# Altium project Popsicle Stick V2.PrjPcb
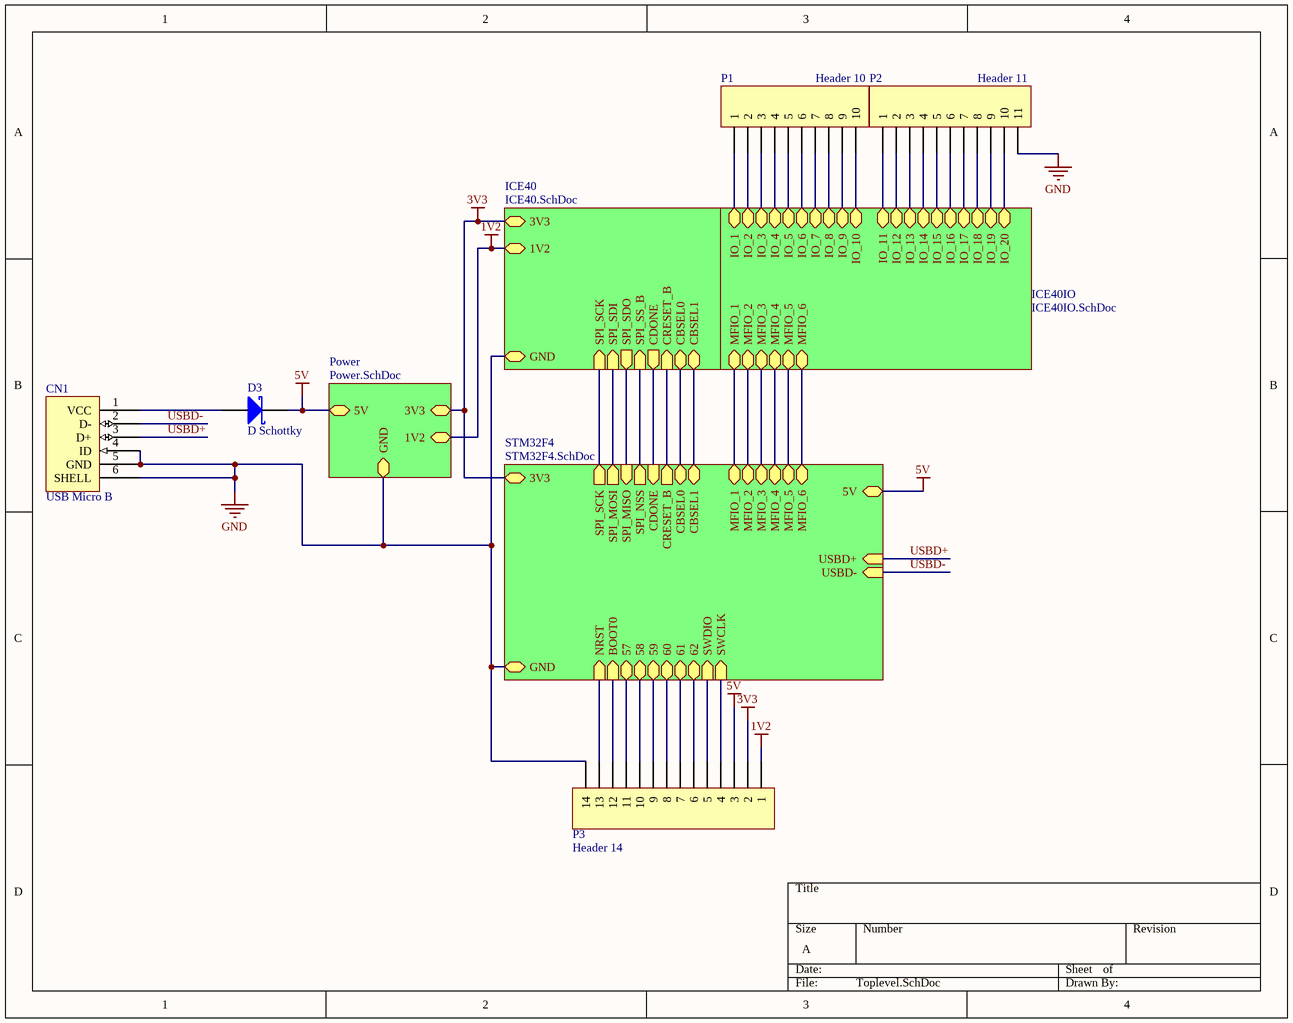
[diagram p0: Toplevel.SchDoc]
5 sheets, 61 parts. Net scope: hierarchical (ports join the sheet entries above them; power ports are global).
Board file: PCB1.PcbDoc
Sheets:
  Toplevel.SchDoc
    Power = Power.SchDoc
    ICE40 = ICE40.SchDoc
    ICE40IO = ICE40IO.SchDoc
    STM32F4 = STM32F4.SchDoc

## Sheet Toplevel.SchDoc
size A

### Parts
CN1  USB Micro B
D3  D Schottky  [SMB]
P1  Header 10  [HDR1X10]
P2  Header 11  [HDR1X11]
P3  Header 14  [HDR1X14]

### Sub-sheets
ICE40 = ICE40.SchDoc: 3V3, 1V2, GND, SPI_SCK (in), SPI_SDI (in), SPI_SDO (out), SPI_SS_B (in), CDONE (out), CRESET_B (in), CBSEL1 (bidir), CBSEL0 (bidir)
ICE40IO = ICE40IO.SchDoc: MFIO_1 (bidir), MFIO_2 (bidir), MFIO_3 (bidir), MFIO_4 (bidir), MFIO_6 (bidir), IO_1 (bidir), IO_2 (bidir), IO_3 (bidir), IO_4 (bidir), IO_5 (bidir), IO_6 (bidir), IO_8 (bidir), IO_9 (bidir), IO_10 (bidir), IO_12 (bidir), IO_13 (bidir), IO_11 (bidir), IO_14 (bidir), IO_15 (bidir), IO_16 (bidir), IO_17 (bidir), IO_18 (bidir), IO_19 (bidir), IO_20 (bidir), IO_7 (bidir), MFIO_5 (bidir)
Power = Power.SchDoc: GND, 5V, 3V3, 1V2
STM32F4 = STM32F4.SchDoc: SPI_SCK (out), SPI_MOSI (out), SPI_MISO (in), SPI_NSS (out), CDONE (in), CRESET_B (out), CBSEL0 (bidir), CBSEL1 (bidir), MFIO_1 (bidir), MFIO_2 (bidir), MFIO_3 (bidir), MFIO_4 (bidir), MFIO_5 (bidir), MFIO_6 (bidir), NRST (in), BOOT0 (in), 57 (bidir), 58 (bidir), 59 (bidir), 60 (bidir), 61 (bidir), 62 (bidir), 3V3, GND, USBD+ (in), USBD- (in), SWCLK (in), SWDIO (in), 5V

### Nets
1V2: P3.1 ; sheet Power/1V2, sheet ICE40/1V2
3V3: P3.2 ; sheet Power/3V3, sheet ICE40/3V3, sheet STM32F4/3V3
5V: D3.2(K) P3.3 ; sheet Power/5V, sheet STM32F4/5V
GND: CN1.4(ID) CN1.5(GND) CN1.6(SHELL) P2.11 P3.14 ; sheet Power/GND, sheet ICE40/GND, sheet STM32F4/GND
USBD+: CN1.3(D+) ; sheet STM32F4/USBD+
USBD-: CN1.2(D-) ; sheet STM32F4/USBD-
NetC28_1: P3.13 ; sheet STM32F4/NRST
NetCN1_1: CN1.1(VCC) D3.1(A)
NetP1_1: P1.1 ; sheet ICE40IO/IO_1
NetP1_2: P1.2 ; sheet ICE40IO/IO_2
NetP1_3: P1.3 ; sheet ICE40IO/IO_3
NetP1_4: P1.4 ; sheet ICE40IO/IO_4
NetP1_5: P1.5 ; sheet ICE40IO/IO_5
NetP1_6: P1.6 ; sheet ICE40IO/IO_6
NetP1_7: P1.7 ; sheet ICE40IO/IO_7
NetP1_8: P1.8 ; sheet ICE40IO/IO_8
NetP1_9: P1.9 ; sheet ICE40IO/IO_9
NetP1_10: P1.10 ; sheet ICE40IO/IO_10
NetP2_1: P2.1 ; sheet ICE40IO/IO_11
NetP2_2: P2.2 ; sheet ICE40IO/IO_12
NetP2_3: P2.3 ; sheet ICE40IO/IO_13
NetP2_4: P2.4 ; sheet ICE40IO/IO_14
NetP2_5: P2.5 ; sheet ICE40IO/IO_15
NetP2_6: P2.6 ; sheet ICE40IO/IO_16
NetP2_7: P2.7 ; sheet ICE40IO/IO_17
NetP2_8: P2.8 ; sheet ICE40IO/IO_18
NetP2_9: P2.9 ; sheet ICE40IO/IO_19
NetP2_10: P2.10 ; sheet ICE40IO/IO_20
NetP3_4: P3.4 ; sheet STM32F4/SWCLK
NetP3_5: P3.5 ; sheet STM32F4/SWDIO
NetP3_6: P3.6 ; sheet STM32F4/62
NetP3_7: P3.7 ; sheet STM32F4/61
NetP3_8: P3.8 ; sheet STM32F4/60
NetP3_9: P3.9 ; sheet STM32F4/59
NetP3_10: P3.10 ; sheet STM32F4/58
NetP3_11: P3.11 ; sheet STM32F4/57
NetP3_12: P3.12 ; sheet STM32F4/BOOT0
NetR3_1: sheet ICE40/CRESET_B, sheet STM32F4/CRESET_B
NetR4_1: sheet ICE40/CDONE, sheet STM32F4/CDONE
NetR5_1: sheet ICE40/SPI_SDI, sheet STM32F4/SPI_MOSI
NetR6_1: sheet ICE40/SPI_SCK, sheet STM32F4/SPI_SCK
NetR7_1: sheet ICE40/SPI_SS_B, sheet STM32F4/SPI_NSS
NetU1_63: sheet ICE40/CBSEL0, sheet STM32F4/CBSEL0
NetU1_64: sheet ICE40/CBSEL1, sheet STM32F4/CBSEL1
NetU1_67: sheet ICE40/SPI_SDO, sheet STM32F4/SPI_MISO
NetU1_73: sheet ICE40IO/MFIO_1, sheet STM32F4/MFIO_1
NetU1_74: sheet ICE40IO/MFIO_2, sheet STM32F4/MFIO_2
NetU1_75: sheet ICE40IO/MFIO_3, sheet STM32F4/MFIO_3
NetU1_76: sheet ICE40IO/MFIO_4, sheet STM32F4/MFIO_4
NetU1_78: sheet ICE40IO/MFIO_5, sheet STM32F4/MFIO_5
NetU1_79: sheet ICE40IO/MFIO_6, sheet STM32F4/MFIO_6

### Library data of the parts
CN1 = USB Micro B: Manuf_Part_1: 5075BMR-05-SM; Order: 5075BMR-05-SM; ECCN: ????
D3 = D Schottky: Schottky Diode; Published: 8-Jun-2000; LatestRevisionDate: 17-Jul-2002; LatestRevisionNote: Re-released for DXP Platform.; PackageReference: SMB; Publisher: Altium Limited; PackageDescription: DO-214-AA/SMB; 2 C-Bend Leads; Body 5.3 x 3.6 mm, inc. leads (LxW); Code_JEDEC: DO-214-AA
P1 = Header 10: Header, 10-Pin; LatestRevisionDate: 17-Jul-2002; LatestRevisionNote: Re-released for DXP Platform.; Publisher: Altium Limited
P2 = Header 11: Header, 11-Pin; LatestRevisionDate: 17-Jul-2002; LatestRevisionNote: Re-released for DXP Platform.; Publisher: Altium Limited
P3 = Header 14: Header, 14-Pin; LatestRevisionDate: 17-Jul-2002; LatestRevisionNote: Re-released for DXP Platform.; Publisher: Altium Limited

## Sheet Power.SchDoc
size A
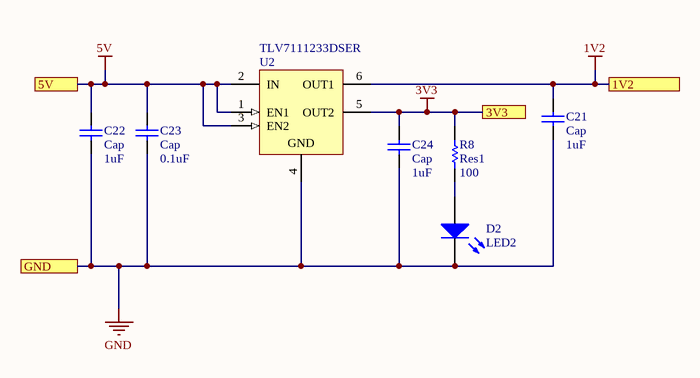
[diagram p1: Power.SchDoc]

### Parts
C21  Cap  value 1uF  [RAD-0.3]
C22  Cap  value 1uF  [RAD-0.3]
C23  Cap  value 0.1uF  [RAD-0.3]
C24  Cap  value 1uF  [RAD-0.3]
D2  LED2  [3.2X1.6X1.1]
R8  Res1  value 100  [AXIAL-0.3]
U2  TLV7111233DSER  [TI-DSE6_V]

### Ports
1V2, 3V3, 5V, GND

### Nets
1V2: C21.2 U2.6(OUT1) ; port 1V2
3V3: C24.2 R8.2 U2.5(OUT2) ; port 3V3
5V: C22.1 C23.2 U2.1(EN1) U2.2(IN) U2.3(EN2) ; port 5V
GND: C21.1 C22.2 C23.1 C24.1 D2.2(K) U2.4(GND) ; port GND
NetD2_1: D2.1(A) R8.1

### Library data of the parts
C21-C24 = Cap: Capacitor; Published: 8-Jun-2000; LatestRevisionDate: 17-Jul-2002; LatestRevisionNote: Re-released for DXP Platform.; PackageReference: RAD-0.3; Publisher: Altium Limited; PackageDescription: Radial Cap, Thru-Hole; 2 Leads; 0.3 in Pin Spacing
D2 = LED2: Typical RED, GREEN, YELLOW, AMBER GaAs LED; Published: 8-Jun-2000; LatestRevisionDate: 17-Jul-2002; LatestRevisionNote: Re-released for DXP Platform.; PackageVersion: Feb-2002; PackageReference: 3.2X1.6X1.1; Publisher: Altium Limited; PackageDescription: SM LED; 2 Flat Leads
R8 = Res1: Resistor; Published: 8-Jun-2000; LatestRevisionDate: 17-Jul-2002; LatestRevisionNote: Re-released for DXP Platform.; PackageReference: AXIAL-0.3; Publisher: Altium Limited; PackageDescription: Axial Device, Thru-Hole; 2 Leads; 0.3 in Pin Spacing
U2 = TLV7111233DSER: Dual Output High PSRR LDO, 200 mA, Fixed 1.2, 3.3 V Output, 2 to 5.5 V Input, 6-pin WSON (DSE), -40 to 125 degC, Green (RoHS & no Sb/Br); Manufacturer: Texas Instruments; Iout(Max)(A): 0.2; Iq(Typ)(mA): 0.03; SubFamily: Dual Channel LDO; Vdo(Typ)(mV): 175; Vin(Max)(V): 5.5; Vin(Min)(V): 2; DatasheetVersion: SBVS142A; PackageVersion: 4207810/A; PackageReference: DSE6; PackageDescription: 6-Pin Plastic Small Outline, Body 1.5 x 1.5 mm, Pitch 0.5 mm; Supplier 1: Digi-Key; Supplier Part Number 1: 296-28453-2-ND; Supplier 2: Digi-Key; Supplier Part Number 2: 296-28453-1-ND; Supplier 3: Digi-Key; Supplier Part Number 3: 296-28453-6-ND; Supplier 4: Mouser; Supplier Part Number 4: 595-TLV7111233DSER; Eco-Plan: Green (RoHS & no Sb/Br); Fixed Output Options(V): 1.2, 3.3; Mounting Technology: Surface Mount; PartNumber: TLV7111233DSER; ComponentLink1Description: Manufacturer URL; ComponentLink1URL: http://www.ti.com/; ComponentLink2Description: Datasheet; ComponentLink2URL: http://www.ti.com/general/docs/lit/getliterature.tsp?genericPartNumber=TLV7111233&fileType=pdf; ComponentLink3Description: Package Specification; ComponentLink3URL: http://www.ti.com/litv/pdf/mpds287

## Sheet ICE40.SchDoc
size A
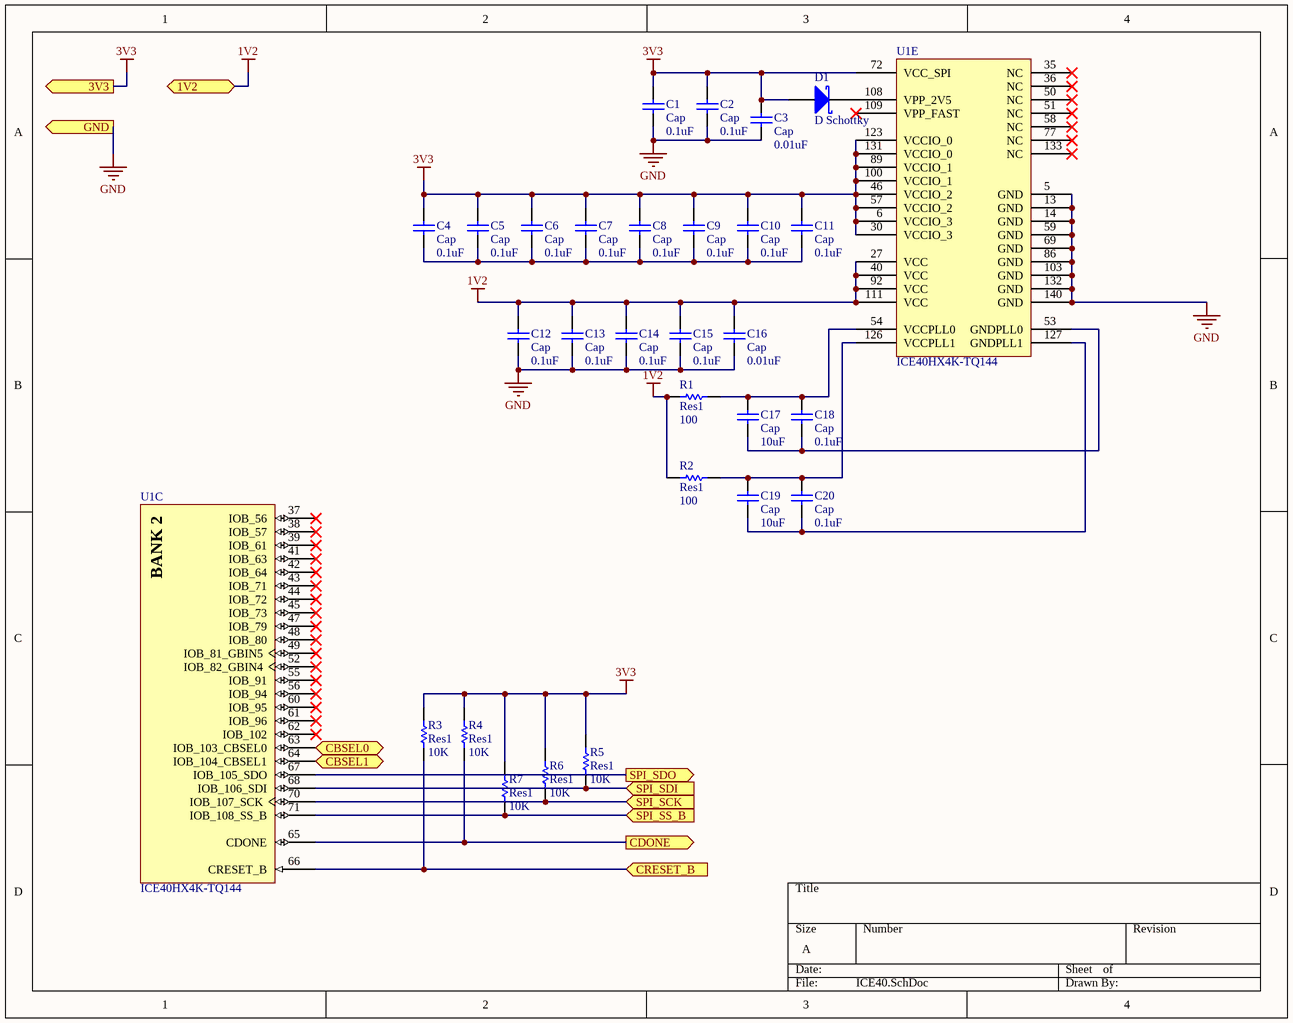
[diagram p2: ICE40.SchDoc]

### Parts
C1  Cap  value 0.1uF  [RAD-0.3]
C2  Cap  value 0.1uF  [RAD-0.3]
C3  Cap  value 0.01uF  [RAD-0.3]
C4  Cap  value 0.1uF  [RAD-0.3]
C5  Cap  value 0.1uF  [RAD-0.3]
C6  Cap  value 0.1uF  [RAD-0.3]
C7  Cap  value 0.1uF  [RAD-0.3]
C8  Cap  value 0.1uF  [RAD-0.3]
C9  Cap  value 0.1uF  [RAD-0.3]
C10  Cap  value 0.1uF  [RAD-0.3]
C11  Cap  value 0.1uF  [RAD-0.3]
C12  Cap  value 0.1uF  [RAD-0.3]
C13  Cap  value 0.1uF  [RAD-0.3]
C14  Cap  value 0.1uF  [RAD-0.3]
C15  Cap  value 0.1uF  [RAD-0.3]
C16  Cap  value 0.01uF  [RAD-0.3]
C17  Cap  value 10uF  [RAD-0.3]
C18  Cap  value 0.1uF  [RAD-0.3]
C19  Cap  value 10uF  [RAD-0.3]
C20  Cap  value 0.1uF  [RAD-0.3]
D1  D Schottky  [SMB]
R1  Res1  value 100  [AXIAL-0.3]
R2  Res1  value 100  [AXIAL-0.3]
R3  Res1  value 10K  [AXIAL-0.3]
R4  Res1  value 10K  [AXIAL-0.3]
R5  Res1  value 10K  [AXIAL-0.3]
R6  Res1  value 10K  [AXIAL-0.3]
R7  Res1  value 10K  [AXIAL-0.3]
U1  ICE40HX4K-TQ144  [LATC-TQFP-144_M]  (parts C,E of 5)

### Ports
1V2, 3V3, CBSEL0 (bidir), CBSEL1 (bidir), CDONE (out), CRESET_B (in), GND, SPI_SCK (in), SPI_SDI (in), SPI_SDO (out), SPI_SS_B (in)

### Nets
1V2: C12.1 C13.1 C14.1 C15.1 C16.1 R1.1 R2.1 U1.27(VCC) U1.40(VCC) U1.92(VCC) U1.111(VCC) ; port 1V2
3V3: C1.1 C2.1 C3.1 C4.1 C5.1 C6.1 C7.1 C8.1 C9.1 C10.1 C11.1 D1.1(A) R3.2 R4.2 R5.2 R6.2 R7.2 U1.6(VCCIO_3) U1.30(VCCIO_3) U1.46(VCCIO_2) U1.57(VCCIO_2) U1.72(VCC_SPI) U1.89(VCCIO_1) U1.100(VCCIO_1) U1.123(VCCIO_0) U1.131(VCCIO_0) ; port 3V3
GND: C1.2 C2.2 C3.2 C12.2 C13.2 C14.2 C15.2 C16.2 U1.5(GND) U1.13(GND) U1.14(GND) U1.59(GND) U1.69(GND) U1.86(GND) U1.103(GND) U1.132(GND) U1.140(GND) ; port GND
NetC4_2: C4.2 C5.2 C6.2 C7.2 C8.2 C9.2 C10.2 C11.2
NetC17_1: C17.1 C18.1 R1.2 U1.54(VCCPLL0)
NetC17_2: C17.2 C18.2 U1.53(GNDPLL0)
NetC19_1: C19.1 C20.1 R2.2 U1.126(VCCPLL1)
NetC19_2: C19.2 C20.2 U1.127(GNDPLL1)
NetD1_2: D1.2(K) U1.108(VPP_2V5)
NetR3_1: R3.1 U1.66(CRESET_B) ; port CRESET_B
NetR4_1: R4.1 U1.65(CDONE) ; port CDONE
NetR5_1: R5.1 U1.68(IOB_106_SDI) ; port SPI_SDI
NetR6_1: R6.1 U1.70(IOB_107_SCK) ; port SPI_SCK
NetR7_1: R7.1 U1.71(IOB_108_SS_B) ; port SPI_SS_B
NetU1_63: U1.63(IOB_103_CBSEL0) ; port CBSEL0
NetU1_64: U1.64(IOB_104_CBSEL1) ; port CBSEL1
NetU1_67: U1.67(IOB_105_SDO) ; port SPI_SDO

Not connected (* = marked no-connect by the designer): U1 35(NC)* 36(NC)* 37(IOB_56)* 38(IOB_57)* 39(IOB_61)* 41(IOB_63)* 42(IOB_64)* 43(IOB_71)* 44(IOB_72)* 45(IOB_73)* 47(IOB_79)* 48(IOB_80)* 49(IOB_81_GBIN5)* 50(NC)* 51(NC)* 52(IOB_82_GBIN4)* 55(IOB_91)* 56(IOB_94)* 58(NC)* 60(IOB_95)* 61(IOB_96)* 62(IOB_102)* 77(NC)* 109(VPP_FAST)* 133(NC)*

### Notes on the sheet
- (in symbol ICE40HX4K-TQ144, part C) BANK 2

### Library data of the parts
C1-C20 = Cap: Capacitor; Published: 8-Jun-2000; LatestRevisionDate: 17-Jul-2002; LatestRevisionNote: Re-released for DXP Platform.; PackageReference: RAD-0.3; Publisher: Altium Limited; PackageDescription: Radial Cap, Thru-Hole; 2 Leads; 0.3 in Pin Spacing
D1 = D Schottky: Schottky Diode; Published: 8-Jun-2000; LatestRevisionDate: 17-Jul-2002; LatestRevisionNote: Re-released for DXP Platform.; PackageReference: SMB; Publisher: Altium Limited; PackageDescription: DO-214-AA/SMB; 2 C-Bend Leads; Body 5.3 x 3.6 mm, inc. leads (LxW); Code_JEDEC: DO-214-AA
R1-R7 = Res1: Resistor; Published: 8-Jun-2000; LatestRevisionDate: 17-Jul-2002; LatestRevisionNote: Re-released for DXP Platform.; PackageReference: AXIAL-0.3; Publisher: Altium Limited; PackageDescription: Axial Device, Thru-Hole; 2 Leads; 0.3 in Pin Spacing
U1 = ICE40HX4K-TQ144: iCE40 HX4K Series FPGA Family, 3520 Logic Cells, 1.2 V Core, 80 K Embedded RAM Bits, 144-pin TQFP, Pb-Free, Tray; Manufacturer: Lattice Semiconductor; Embedded RAM Bits: 80K; Logic Cells: 3520; Phase-Locked Loops: 2; Supply Voltage: 1.2V; DatasheetVersion: Rev. 02.9; PackageVersion: Rev. 03.9, 02/2013; PackageReference: TQFP-144; PackageDescription: 144-Pin Thin Quad Flat Package, Body 20 x 20 mm, Pitch 0.5 mm; Supplier 1: Digi-Key; Supplier Part Number 1: 220-1572-ND; Supplier 2: Mouser; Supplier Part Number 2: 842-ICE40HX4K-TQ144; Packing: Tray; RoHS: TRUE; Mounting Technology: Surface Mount; PartNumber: ICE40HX4K-TQ144; ComponentLink1Description: Manufacturer URL; ComponentLink1URL: http://www.latticesemi.com/en; ComponentLink2Description: Datasheet; ComponentLink2URL: http://www.latticesemi.com/~/media/Documents/DataSheets/iCE/iCE40LPHXFamilyDataSheet.pdf; ComponentLink3Description: Package Specification; ComponentLink3URL: http://www.latticesemi.com/lit/docs/package/pkg.pdf

## Sheet ICE40IO.SchDoc
size A
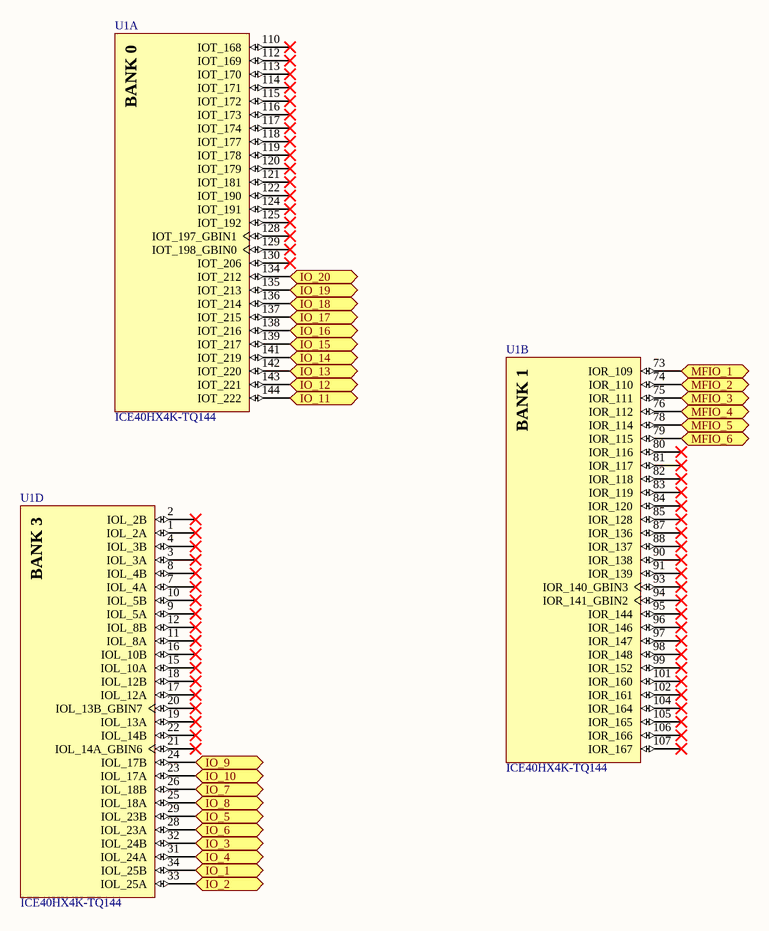
[diagram p3: ICE40IO.SchDoc]

### Parts
U1  ICE40HX4K-TQ144  [LATC-TQFP-144_M]  (parts A,B,D of 5)

### Ports
IO_1 (bidir), IO_2 (bidir), IO_3 (bidir), IO_4 (bidir), IO_5 (bidir), IO_6 (bidir), IO_7 (bidir), IO_8 (bidir), IO_9 (bidir), IO_10 (bidir), IO_11 (bidir), IO_12 (bidir), IO_13 (bidir), IO_14 (bidir), IO_15 (bidir), IO_16 (bidir), IO_17 (bidir), IO_18 (bidir), IO_19 (bidir), IO_20 (bidir), MFIO_1 (bidir), MFIO_2 (bidir), MFIO_3 (bidir), MFIO_4 (bidir), MFIO_5 (bidir), MFIO_6 (bidir)

### Nets
NetP1_1: U1.34(IOL_25B) ; port IO_1
NetP1_2: U1.33(IOL_25A) ; port IO_2
NetP1_3: U1.32(IOL_24B) ; port IO_3
NetP1_4: U1.31(IOL_24A) ; port IO_4
NetP1_5: U1.29(IOL_23B) ; port IO_5
NetP1_6: U1.28(IOL_23A) ; port IO_6
NetP1_7: U1.26(IOL_18B) ; port IO_7
NetP1_8: U1.25(IOL_18A) ; port IO_8
NetP1_9: U1.24(IOL_17B) ; port IO_9
NetP1_10: U1.23(IOL_17A) ; port IO_10
NetP2_1: U1.144(IOT_222) ; port IO_11
NetP2_2: U1.143(IOT_221) ; port IO_12
NetP2_3: U1.142(IOT_220) ; port IO_13
NetP2_4: U1.141(IOT_219) ; port IO_14
NetP2_5: U1.139(IOT_217) ; port IO_15
NetP2_6: U1.138(IOT_216) ; port IO_16
NetP2_7: U1.137(IOT_215) ; port IO_17
NetP2_8: U1.136(IOT_214) ; port IO_18
NetP2_9: U1.135(IOT_213) ; port IO_19
NetP2_10: U1.134(IOT_212) ; port IO_20
NetU1_73: U1.73(IOR_109) ; port MFIO_1
NetU1_74: U1.74(IOR_110) ; port MFIO_2
NetU1_75: U1.75(IOR_111) ; port MFIO_3
NetU1_76: U1.76(IOR_112) ; port MFIO_4
NetU1_78: U1.78(IOR_114) ; port MFIO_5
NetU1_79: U1.79(IOR_115) ; port MFIO_6

Not connected (* = marked no-connect by the designer): U1 1(IOL_2A)* 2(IOL_2B)* 3(IOL_3A)* 4(IOL_3B)* 7(IOL_4A)* 8(IOL_4B)* 9(IOL_5A)* 10(IOL_5B)* 11(IOL_8A)* 12(IOL_8B)* 15(IOL_10A)* 16(IOL_10B)* 17(IOL_12A)* 18(IOL_12B)* 19(IOL_13A)* 20(IOL_13B_GBIN7)* 21(IOL_14A_GBIN6)* 22(IOL_14B)* 80(IOR_116)* 81(IOR_117)* 82(IOR_118)* 83(IOR_119)* 84(IOR_120)* 85(IOR_128)* 87(IOR_136)* 88(IOR_137)* 90(IOR_138)* 91(IOR_139)* 93(IOR_140_GBIN3)* 94(IOR_141_GBIN2)* 95(IOR_144)* 96(IOR_146)* 97(IOR_147)* 98(IOR_148)* 99(IOR_152)* 101(IOR_160)* 102(IOR_161)* 104(IOR_164)* 105(IOR_165)* 106(IOR_166)* 107(IOR_167)* 110(IOT_168)* 112(IOT_169)* 113(IOT_170)* 114(IOT_171)* 115(IOT_172)* 116(IOT_173)* 117(IOT_174)* 118(IOT_177)* 119(IOT_178)* 120(IOT_179)* 121(IOT_181)* 122(IOT_190)* 124(IOT_191)* 125(IOT_192)* 128(IOT_197_GBIN1)* 129(IOT_198_GBIN0)* 130(IOT_206)*

### Notes on the sheet
- (in symbol ICE40HX4K-TQ144, part A) BANK 0
- (in symbol ICE40HX4K-TQ144, part B) BANK 1
- (in symbol ICE40HX4K-TQ144, part D) BANK 3

### Library data of the parts
U1 = ICE40HX4K-TQ144: as U1 on sheet ICE40; DatasheetVersion: Rev. 02.9; PackageVersion: Rev. 03.9, 02/2013; PackageReference: TQFP-144; PackageDescription: 144-Pin Thin Quad Flat Package, Body 20 x 20 mm, Pitch 0.5 mm; Supplier 1: Digi-Key; Supplier Part Number 1: 220-1572-ND; Supplier 2: Mouser; Supplier Part Number 2: 842-ICE40HX4K-TQ144; Packing: Tray; RoHS: TRUE; Mounting Technology: Surface Mount; PartNumber: ICE40HX4K-TQ144; ComponentLink1Description: Manufacturer URL; ComponentLink1URL: http://www.latticesemi.com/en; ComponentLink2Description: Datasheet; ComponentLink2URL: http://www.latticesemi.com/~/media/Documents/DataSheets/iCE/iCE40LPHXFamilyDataSheet.pdf; ComponentLink3Description: Package Specification; ComponentLink3URL: http://www.latticesemi.com/lit/docs/package/pkg.pdf

## Sheet STM32F4.SchDoc
size A
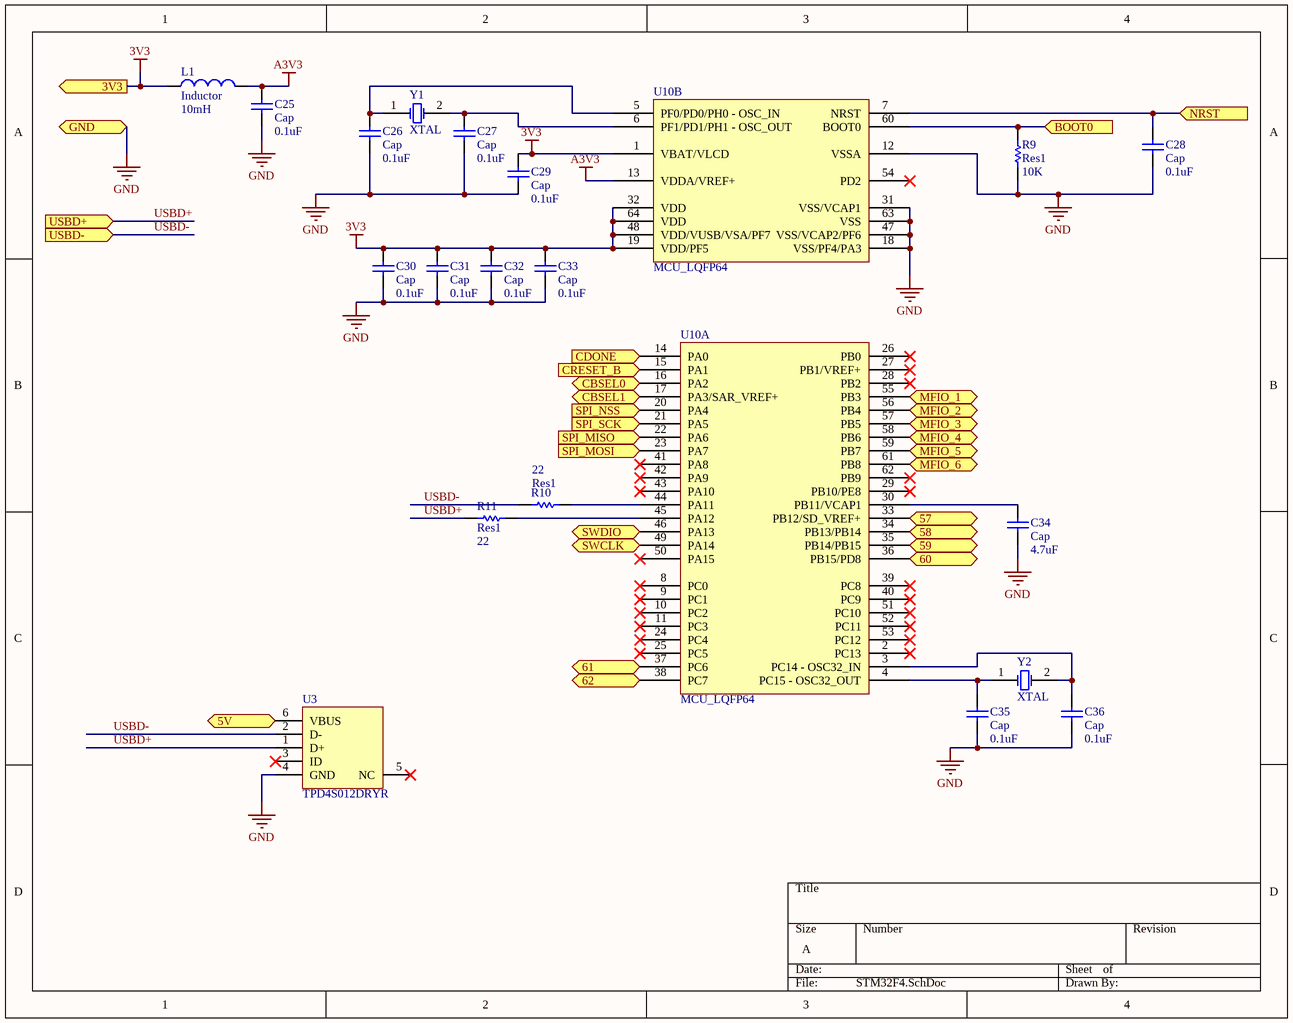
[diagram p4: STM32F4.SchDoc]

### Parts
C25  Cap  value 0.1uF  [RAD-0.3]
C26  Cap  value 0.1uF  [RAD-0.3]
C27  Cap  value 0.1uF  [RAD-0.3]
C28  Cap  value 0.1uF  [RAD-0.3]
C29  Cap  value 0.1uF  [RAD-0.3]
C30  Cap  value 0.1uF  [RAD-0.3]
C31  Cap  value 0.1uF  [RAD-0.3]
C32  Cap  value 0.1uF  [RAD-0.3]
C33  Cap  value 0.1uF  [RAD-0.3]
C34  Cap  value 4.7uF  [RAD-0.3]
C35  Cap  value 0.1uF  [RAD-0.3]
C36  Cap  value 0.1uF  [RAD-0.3]
L1  Inductor  value 10mH  [0402-A]
R9  Res1  value 10K  [AXIAL-0.3]
R10  Res1  value 22  [AXIAL-0.3]
R11  Res1  value 22  [AXIAL-0.3]
U3  TPD4S012DRYR  [DRY6]
U10  MCU_LQFP64  [STM-LQFP64_M]  (parts A,B of 2)
Y1  XTAL  [R38]
Y2  XTAL  [R38]

### Ports
3V3, 5V, 57 (bidir), 58 (bidir), 59 (bidir), 60 (bidir), 61 (bidir), 62 (bidir), BOOT0 (in), CBSEL0 (bidir), CBSEL1 (bidir), CDONE (in), CRESET_B (out), GND, MFIO_1 (bidir), MFIO_2 (bidir), MFIO_3 (bidir), MFIO_4 (bidir), MFIO_5 (bidir), MFIO_6 (bidir), NRST (in), SPI_MISO (in), SPI_MOSI (out), SPI_NSS (out), SPI_SCK (out), SWCLK (in), SWDIO (in), USBD+ (in), USBD- (in)

### Nets
3V3: C29.1 C30.1 C31.1 C32.1 C33.1 L1.1 U10.1(VBAT/VLCD) U10.19(VDD/PF5) U10.32(VDD) U10.48(VDD/VUSB/VSA/PF7) U10.64(VDD) ; port 3V3
5V: U3.6(VBUS) ; port 5V
A3V3: C25.1 L1.2 U10.13(VDDA/VREF+)
GND: C25.2 C26.2 C27.2 C28.2 C29.2 C30.2 C31.2 C32.2 C33.2 C34.2 C35.2 C36.2 R9.1 U3.4(GND) U10.12(VSSA) U10.18(VSS/PF4/PA3) U10.31(VSS/VCAP1) U10.47(VSS/VCAP2/PF6) U10.63(VSS) ; port GND
USBD+: R11.2 U3.1(D+) ; port USBD+
USBD-: R10.2 U3.2(D-) ; port USBD-
NetC26_1: C26.1 U10.5(PF0/PD0/PH0_-_OSC_IN) Y1.1(OSC1)
NetC27_1: C27.1 U10.6(PF1/PD1/PH1_-_OSC_OUT) Y1.2(OSC2)
NetC28_1: C28.1 U10.7(NRST) ; port NRST
NetC34_1: C34.1 U10.30(PB11/VCAP1)
NetC35_1: C35.1 U10.4(PC15_-_OSC32_OUT) Y2.1(OSC1)
NetC36_1: C36.1 U10.3(PC14_-_OSC32_IN) Y2.2(OSC2)
NetP3_4: U10.49(PA14) ; port SWCLK
NetP3_5: U10.46(PA13) ; port SWDIO
NetP3_6: U10.38(PC7) ; port 62
NetP3_7: U10.37(PC6) ; port 61
NetP3_8: U10.36(PB15/PD8) ; port 60
NetP3_9: U10.35(PB14/PB15) ; port 59
NetP3_10: U10.34(PB13/PB14) ; port 58
NetP3_11: U10.33(PB12/SD_VREF+) ; port 57
NetP3_12: R9.2 U10.60(BOOT0) ; port BOOT0
NetR3_1: U10.15(PA1) ; port CRESET_B
NetR4_1: U10.14(PA0) ; port CDONE
NetR5_1: U10.23(PA7) ; port SPI_MOSI
NetR6_1: U10.21(PA5) ; port SPI_SCK
NetR7_1: U10.20(PA4) ; port SPI_NSS
NetR10_1: R10.1 U10.44(PA11)
NetR11_1: R11.1 U10.45(PA12)
NetU1_63: U10.16(PA2) ; port CBSEL0
NetU1_64: U10.17(PA3/SAR_VREF+) ; port CBSEL1
NetU1_67: U10.22(PA6) ; port SPI_MISO
NetU1_73: U10.55(PB3) ; port MFIO_1
NetU1_74: U10.56(PB4) ; port MFIO_2
NetU1_75: U10.57(PB5) ; port MFIO_3
NetU1_76: U10.58(PB6) ; port MFIO_4
NetU1_78: U10.59(PB7) ; port MFIO_5
NetU1_79: U10.61(PB8) ; port MFIO_6

Not connected (* = marked no-connect by the designer): U3 3(ID)* 5(NC)*; U10 2(PC13)* 8(PC0)* 9(PC1)* 10(PC2)* 11(PC3)* 24(PC4)* 25(PC5)* 26(PB0)* 27(PB1/VREF+)* 28(PB2)* 29(PB10/PE8)* 39(PC8)* 40(PC9)* 41(PA8)* 42(PA9)* 43(PA10)* 50(PA15)* 51(PC10)* 52(PC11)* 53(PC12)* 54(PD2)* 62(PB9)*

### Library data of the parts
C25-C36 = Cap: Capacitor; Published: 8-Jun-2000; LatestRevisionDate: 17-Jul-2002; LatestRevisionNote: Re-released for DXP Platform.; PackageReference: RAD-0.3; Publisher: Altium Limited; PackageDescription: Radial Cap, Thru-Hole; 2 Leads; 0.3 in Pin Spacing
L1 = Inductor: Code_IEC: 1005; Published: 8-Jun-2000; LatestRevisionDate: 29-May-2009; LatestRevisionNote: IPC-7351 Footprint Added.; PackageReference: 0402-A; Publisher: Altium Limited; PackageDescription: Chip Inductor; Code_JEITA: 0402
R9-R11 = Res1: Resistor; Published: 8-Jun-2000; LatestRevisionDate: 17-Jul-2002; LatestRevisionNote: Re-released for DXP Platform.; PackageReference: AXIAL-0.3; Publisher: Altium Limited; PackageDescription: Axial Device, Thru-Hole; 2 Leads; 0.3 in Pin Spacing
U3 = TPD4S012DRYR: USB ESD Solution with Power Clamp, 4 Channels, -40 to +85 degC, 6-pin SON (DRY), Green (RoHS & no Sb/Br); Manufacturer: Texas Instruments; Breakdown Voltage(Min)(V): 6; IEC 61000-4-2 Air-Gap(+/- kV): 10; IO Capacitance(Typ)(pF): 0.8; USB High Speed: TRUE; DatasheetVersion: SLVS928A; PackageVersion: revF, Dec-2011; PackageReference: DRY6; PackageDescription: 6-Pin Plastic Small Outline No-Lead, 1 x 1.45 x 0.6 mm Body, 0.5 mm Pitch; Supplier 1: Digi-Key; Supplier Part Number 1: 296-24244-2-ND; Supplier 2: Digi-Key; Supplier Part Number 2: 296-24244-1-ND; Supplier 3: Digi-Key; Supplier Part Number 3: 296-24244-6-ND; Supplier 4: Farnell; Supplier Part Number 4: 1755332; Supplier 5: Newark; Supplier Part Number 5: 73P5280; Supplier 6: Mouser; Supplier Part Number 6: 595-TPD4S012DRYR; Eco-Plan: Green (RoHS & no Sb/Br); IEC 61000-4-2 Contact(+/- kV): 10; IO Leakage Current(nA): 10; SubFamily: ESD Solution; Mounting Technology: Surface Mount; PartNumber: TPD4S012DRYR; ComponentLink1Description: Datasheet; ComponentLink1URL: http://www.ti.com/general/docs/lit/getliterature.tsp?genericPartNumber=TPD4S012&fileType=pdf; ComponentLink2Description: URL Link1; ComponentLink2URL: SamplesURL:http://www.ti.com/product/tpd4s012#samples
Y1 Y2 = XTAL: Crystal Oscillator; Published: 8-Jun-2000; LatestRevisionDate: 17-Jul-2002; LatestRevisionNote: Re-released for DXP Platform.; PackageReference: R38; Publisher: Altium Limited; PackageDescription: Crystal, Thru-Hole; 2 Leads; Body 3.1 x 8.2 mm (Dia.xH)

## Nets that join several sheets
1V2: Toplevel (P3.1), Power (C21.2 U2.6), ICE40 (11 pins)
3V3: Toplevel (P3.2), Power (C24.2 R8.2 U2.5), ICE40 (26 pins), STM32F4 (11 pins)
5V: Toplevel (D3.2 P3.3), Power (5 pins), STM32F4 (U3.6)
GND: Toplevel (5 pins), Power (6 pins), ICE40 (17 pins), STM32F4 (19 pins)
NetC28_1: Toplevel (P3.13), STM32F4 (C28.1 U10.7)
NetP1_1: Toplevel (P1.1), ICE40IO (U1.34)
NetP1_2: Toplevel (P1.2), ICE40IO (U1.33)
NetP1_3: Toplevel (P1.3), ICE40IO (U1.32)
NetP1_4: Toplevel (P1.4), ICE40IO (U1.31)
NetP1_5: Toplevel (P1.5), ICE40IO (U1.29)
NetP1_6: Toplevel (P1.6), ICE40IO (U1.28)
NetP1_7: Toplevel (P1.7), ICE40IO (U1.26)
NetP1_8: Toplevel (P1.8), ICE40IO (U1.25)
NetP1_9: Toplevel (P1.9), ICE40IO (U1.24)
NetP1_10: Toplevel (P1.10), ICE40IO (U1.23)
NetP2_1: Toplevel (P2.1), ICE40IO (U1.144)
NetP2_2: Toplevel (P2.2), ICE40IO (U1.143)
NetP2_3: Toplevel (P2.3), ICE40IO (U1.142)
NetP2_4: Toplevel (P2.4), ICE40IO (U1.141)
NetP2_5: Toplevel (P2.5), ICE40IO (U1.139)
NetP2_6: Toplevel (P2.6), ICE40IO (U1.138)
NetP2_7: Toplevel (P2.7), ICE40IO (U1.137)
NetP2_8: Toplevel (P2.8), ICE40IO (U1.136)
NetP2_9: Toplevel (P2.9), ICE40IO (U1.135)
NetP2_10: Toplevel (P2.10), ICE40IO (U1.134)
NetP3_4: Toplevel (P3.4), STM32F4 (U10.49)
NetP3_5: Toplevel (P3.5), STM32F4 (U10.46)
NetP3_6: Toplevel (P3.6), STM32F4 (U10.38)
NetP3_7: Toplevel (P3.7), STM32F4 (U10.37)
NetP3_8: Toplevel (P3.8), STM32F4 (U10.36)
NetP3_9: Toplevel (P3.9), STM32F4 (U10.35)
NetP3_10: Toplevel (P3.10), STM32F4 (U10.34)
NetP3_11: Toplevel (P3.11), STM32F4 (U10.33)
NetP3_12: Toplevel (P3.12), STM32F4 (R9.2 U10.60)
NetR3_1: ICE40 (R3.1 U1.66), STM32F4 (U10.15)
NetR4_1: ICE40 (R4.1 U1.65), STM32F4 (U10.14)
NetR5_1: ICE40 (R5.1 U1.68), STM32F4 (U10.23)
NetR6_1: ICE40 (R6.1 U1.70), STM32F4 (U10.21)
NetR7_1: ICE40 (R7.1 U1.71), STM32F4 (U10.20)
NetU1_63: ICE40 (U1.63), STM32F4 (U10.16)
NetU1_64: ICE40 (U1.64), STM32F4 (U10.17)
NetU1_67: ICE40 (U1.67), STM32F4 (U10.22)
NetU1_73: ICE40IO (U1.73), STM32F4 (U10.55)
NetU1_74: ICE40IO (U1.74), STM32F4 (U10.56)
NetU1_75: ICE40IO (U1.75), STM32F4 (U10.57)
NetU1_76: ICE40IO (U1.76), STM32F4 (U10.58)
NetU1_78: ICE40IO (U1.78), STM32F4 (U10.59)
NetU1_79: ICE40IO (U1.79), STM32F4 (U10.61)
USBD+: Toplevel (CN1.3), STM32F4 (R11.2 U3.1)
USBD-: Toplevel (CN1.2), STM32F4 (R10.2 U3.2)